# Altium schematic sheet GD32xx - Copy.SchDoc
size A3
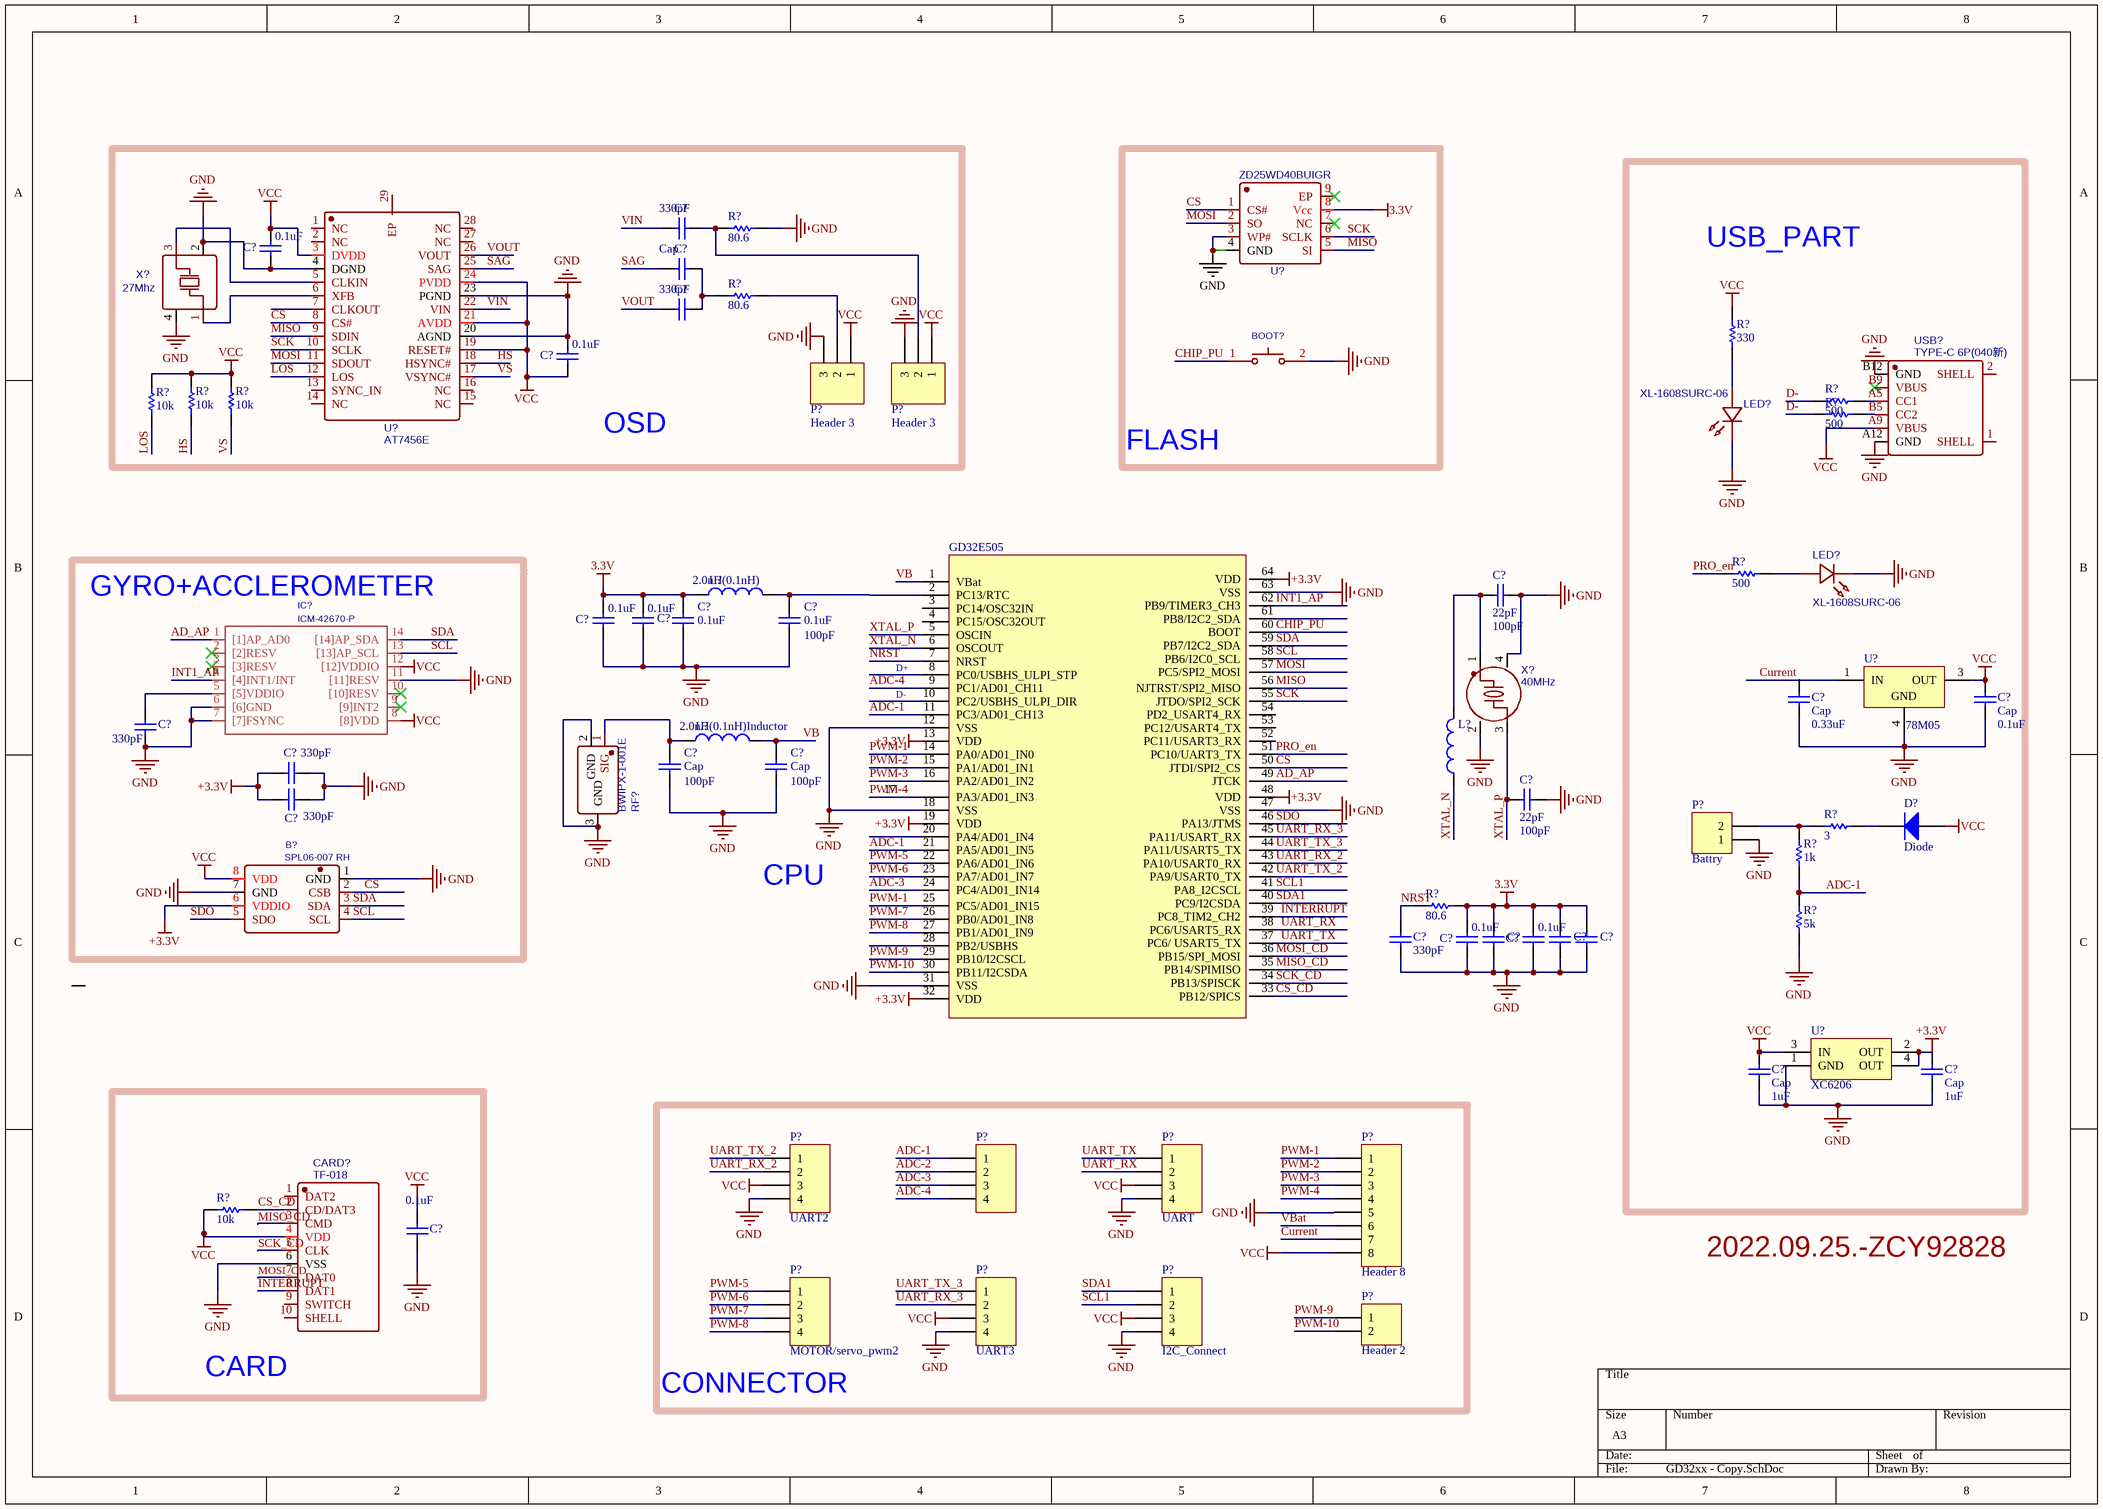
[diagram p0: GD32xx - Copy.SchDoc]

## Parts
(Parts that share a designator on the sheet are numbered #1, #2 ... from top to bottom, then left to right.)
B?  SPL06-007 RH  [SPI060007]
BOOT?  BUTTON2  [BOOT]  (value not drawn)
C?#1  330pF  [INDIA_SOP]
C?#2  0.1uF  [INDIA_SOP]
C?#3  Cap  [INDIA_SOP]
C?#4  330pF  [INDIA_SOP]
C?#5  0.1uF  [INDIA_SOP]
C?#6  22pF  value 100pF  [INDIA_SOP]
C?#7  0.1uF  [INDIA_SOP]
C?#8  0.1uF  [INDIA_SOP]
C?#9  0.1uF  [INDIA_SOP]
C?#10  0.1uF  value 100pF  [INDIA_SOP]
C?#11  Cap  value 0.33uF  [INDIA_SOP]
C?#12  Cap  value 0.1uF  [INDIA_SOP]
C?#13  330pF  [INDIA_SOP]
C?#14  330pF  [INDIA_SOP]
C?#15  Cap  value 100pF  [INDIA_SOP]
C?#16  Cap  value 100pF  [INDIA_SOP]
C?#17  330pF  [INDIA_SOP]
C?#18  22pF  value 100pF  [INDIA_SOP]
C?#19  0.1uF  [INDIA_SOP]
C?#20  0.1uF  [INDIA_SOP]  (value not drawn)
C?#21  0.1uF  [INDIA_SOP]
C?#22  0.1uF  [INDIA_SOP]  (value not drawn)
C?#23  0.1uF  [INDIA_SOP]  (value not drawn)
C?#24  330pF  [INDIA_SOP]
C?#25  Cap  value 1uF  [INDIA_SOP]
C?#26  Cap  value 1uF  [INDIA_SOP]
C?#27  0.1uF  [INDIA_SOP]
CARD?  TF-018  [SD_CARD]
D?  Diode  [SMC]
GD32E505  GD32?  [ESP32]  (value not drawn)
IC?  ICM-42670-P  [ICM42670]
L?#1  2.0nH(0.1nH)  [0402-A]
L?#2  2.0nH(0.1nH)Inductor  [0402-A]
L?#3  Inductor  [0402-A]  (value not drawn)
LED?#1  XL-1608SURC-06  [LED]
LED?#2  XL-1608SURC-06  [LED]
P?#1  Header 3  [HDR1X3]
P?#2  Header 3  [HDR1X3]
P?#3  Battry  [HDR1X2]
P?#4  UART2  [HDR1X4]
P?#5  MOTOR/servo_pwm2  [HDR1X4]  (value not drawn)
P?#6  UART  [HDR1X4]
P?#7  Header 8  [HDR1X8]
P?#8  MOTOR/servo_pwm2  [HDR1X4]
P?#9  UART3  [HDR1X4]
P?#10  I2C_Connect  [HDR1X4]
P?#11  Header 2  [HDR1X2]
R?#1  80.6  [INDIA_SOP]
R?#2  80.6  [INDIA_SOP]
R?#3  330  [INDIA_SOP]
R?#4  10k  [INDIA_SOP]
R?#5  10k  [INDIA_SOP]
R?#6  10k  [INDIA_SOP]
R?#7  500  [INDIA_SOP]
R?#8  500  [INDIA_SOP]
R?#9  500  [INDIA_SOP]
R?#10  1k  [INDIA_SOP]
R?#11  3  [INDIA_SOP]
R?#12  80.6  [INDIA_SOP]
R?#13  5k  [INDIA_SOP]
R?#14  10k  [INDIA_SOP]
RF?  BWIPX-1-001E  [RF]
U?#1  ZD25WD40BUIGR  [25_FLASH]
U?#2  AT7456E  [AD7456]
U?#3  78M05  [TD03B_N]
U?#4  XC6206  [XC6206]
USB?  TYPE-C 6P(040新)  [USB2.0]
X?#1  27Mhz  [CRYSTAL]
X?#2  40MHz  [CRYSTAL]

## Blocks framed on the sheet
OSD: C?#1-C?#5 P?#1 P?#2 R?#1 R?#2 R?#4-R?#6 U?#2 X?#1
FLASH: BOOT? U?#1
USB_PART: C?#11 C?#12 C?#25 C?#26 D? LED?#1 LED?#2 P?#3 R?#3 R?#7-R?#11 R?#13 U?#3 U?#4 USB?
GYRO+ACCLEROMETER: B? C?#13 C?#14 C?#17 IC?
CARD: C?#27 CARD? R?#14
CONNECTOR: P?#4-P?#11

## Nets
3.3V: C?#7.1 C?#8.1 C?#9.2 C?#19.1 C?#20.1 C?#21.1 C?#22.1 C?#23.1 L?#1.1 R?#12.2 U?#1.8(Vcc)
+3.3V: B?.6(VDDIO) C?#14.1 C?#17.1 GD32E505.13(VDD) GD32E505.19(VDD) GD32E505.32(VDD) GD32E505.48(VDD) GD32E505.64(VDD) U?#4.2(OUT) U?#4.4(OUT)
GND: B?.1(GND) B?.7(GND) BOOT?.2 C?#2.2 C?#5.1 C?#6.1 C?#7.2 C?#8.2 C?#9.1 C?#10.1 C?#11.2 C?#12.2 C?#13.1 C?#14.2 C?#15.1 C?#16.1 C?#17.2 C?#18.1 C?#19.2 C?#20.2 C?#21.2 C?#22.2 C?#23.2 C?#24.1 C?#25.2 C?#26.2 C?#27.1 CARD?.6(VSS) GD32E505.12(VSS) GD32E505.18(VSS) GD32E505.31(VSS) GD32E505.47(VSS) GD32E505.63(VSS) IC?.6([6]GND) IC?.7([7]FSYNC) IC?.11([11]RESV) LED?#1.1(K) LED?#2.1(K) P?#1.3 P?#2.3 P?#3.1 P?#4.4 P?#6.4 P?#7.5 P?#9.4 P?#10.4 R?#1.1 R?#13.2 RF?.2(GND) RF?.3(GND) U?#1.3(WP#) U?#1.4(GND) U?#2.4(DGND) U?#2.20(AGND) U?#2.23(PGND) U?#3.4(GND) U?#4.1(GND) USB?.A12(GND) USB?.B12(GND) X?#1.2(GND) X?#1.4(GND) X?#2.2(GND) X?#2.4(GND)
VCC: B?.8(VDD) C?#2.1 C?#5.2 C?#12.1 C?#25.1 C?#27.2 CARD?.4(VDD) D?.1(A) IC?.8([8]VDD) IC?.12([12]VDDIO) P?#1.1 P?#2.1 P?#4.3 P?#6.3 P?#7.8 P?#9.3 P?#10.3 R?#3.2 R?#4.1 R?#5.1 R?#6.1 R?#14.2 U?#2.3(DVDD) U?#2.19(RESET#) U?#2.21(AVDD) U?#2.24(PVDD) U?#3.3(OUT) U?#4.3(IN) USB?.A9(VBUS)
AD_AP: GD32E505.49(JTCK) IC?.1([1]AP_AD0)
ADC-1: GD32E505.11(PC3/AD01_CH13) GD32E505.21(PA5/AD01_IN5) P?#5.1 R?#10.2 R?#13.1
ADC-2: P?#5.2
ADC-3: GD32E505.24(PC4/AD01_IN14) P?#5.3
ADC-4: GD32E505.9(PC1/AD01_CH11) P?#5.4
CHIP_PU: BOOT?.1 GD32E505.60(BOOT)
CS: B?.2(CSB) GD32E505.50(JTDI/SPI2_CS) U?#1.1(CS#) U?#2.8(CS#)
CS_CD: CARD?.2(CD/DAT3) GD32E505.33(PB12/SPICS) R?#14.1
Current: P?#7.7 U?#3.1(IN)
D+: GD32E505.8(PC0/USBHS_ULPI_STP)
D-: GD32E505.10(PC2/USBHS_ULPI_DIR) R?#7.2 R?#8.2
HS: R?#5.2 U?#2.18(HSYNC#)
INT1_AP: GD32E505.62(PB9/TIMER3_CH3) IC?.4([4]INT1/INT)
INTERRUPT: CARD?.8(DAT1) GD32E505.39(PC8_TIM2_CH2)
LOS: R?#4.2 U?#2.12(LOS)
MISO: GD32E505.56(NJTRST/SPI2_MISO) U?#1.5(SI) U?#2.9(SDIN)
MISO_CD: CARD?.3(CMD) GD32E505.35(PB14/SPIMISO)
MOSI: GD32E505.57(PC5/SPI2_MOSI) U?#1.2(SO) U?#2.11(SDOUT)
MOSI_CD: CARD?.7(DAT0) GD32E505.36(PB15/SPI_MOSI)
NRST: C?#24.2 GD32E505.7(NRST) R?#12.1
PRO_en: GD32E505.51(PC10/UART3_TX) R?#9.2
PWM-1: GD32E505.14(PA0/AD01_IN0) GD32E505.25(PC5/AD01_IN15) P?#7.1
PWM-2: GD32E505.15(PA1/AD01_IN1) P?#7.2
PWM-3: GD32E505.16(PA2/AD01_IN2) P?#7.3
PWM-4: GD32E505.17(PA3/AD01_IN3) P?#7.4
PWM-5: GD32E505.22(PA6/AD01_IN6) P?#8.1
PWM-6: GD32E505.23(PA7/AD01_IN7) P?#8.2
PWM-7: GD32E505.26(PB0/AD01_IN8) P?#8.3
PWM-8: GD32E505.27(PB1/AD01_IN9) P?#8.4
PWM-9: GD32E505.29(PB10/I2CSCL) P?#11.1
PWM-10: GD32E505.30(PB11/I2CSDA) P?#11.2
SAG: C?#3.1 U?#2.25(SAG)
SCK: GD32E505.55(JTDO/SPI2_SCK) U?#1.6(SCLK) U?#2.10(SCLK)
SCK_CD: CARD?.5(CLK) GD32E505.34(PB13/SPISCK)
SCL: B?.4(SCL) GD32E505.58(PB6/I2C0_SCL) IC?.13([13]AP_SCL)
SCL1: GD32E505.41(PA8_I2CSCL) P?#10.2
SDA: B?.3(SDA) GD32E505.59(PB7/I2C2_SDA) IC?.14([14]AP_SDA)
SDA1: GD32E505.40(PC9/I2CSDA) P?#10.1
SDO: B?.5(SDO) GD32E505.46(PA13/JTMS)
UART_RX: GD32E505.38(PC6/USART5_RX) P?#6.2
UART_RX_2: GD32E505.43(PA10/USART0_RX) P?#4.2
UART_RX_3: GD32E505.45(PA11/USART_RX) P?#9.2
UART_TX: GD32E505.37(PC6/_USART5_TX) P?#6.1
UART_TX_2: GD32E505.42(PA9/USART0_TX) P?#4.1
UART_TX_3: GD32E505.44(PA11/USART5_TX) P?#9.1
VB: C?#16.2 GD32E505.1(VBat) L?#2.2
VBat: P?#7.6
VIN: C?#1.1 U?#2.22(VIN)
VOUT: C?#4.1 U?#2.26(VOUT)
VS: R?#6.2 U?#2.17(VSYNC#)
XTAL_N: GD32E505.6(OSCOUT) L?#3.1
XTAL_P: C?#18.2 GD32E505.5(OSCIN) X?#2.3
NetC?#1_2: C?#1.2 P?#2.2 R?#1.2
NetC?#3_2: C?#3.2 C?#4.2 R?#2.2
NetC?#6_2: C?#6.2 L?#3.2 X?#2.1
NetC?#10_2: C?#10.2 GD32E505.2(PC13/RTC) L?#1.2
NetC?#13_2: C?#13.2 IC?.5([5]VDDIO)
NetC?#15_2: C?#15.2 L?#2.1 RF?.1(SIG)
NetD?_2: D?.2(K) R?#11.1
NetLED?#1_2: LED?#1.2(A) R?#3.1
NetLED?#2_2: LED?#2.2(A) R?#9.1
NetP?#1_2: P?#1.2 R?#2.1
NetP?#3_2: P?#3.2 R?#10.1 R?#11.2
NetR?#7_1: R?#7.1 USB?.A5(CC1)
NetR?#8_1: R?#8.1 USB?.B5(CC2)
NetU?#2_5: U?#2.5(CLKIN) X?#1.3(OSC2)
NetU?#2_6: U?#2.6(XFB) X?#1.1(OSC1)

Not connected (* = marked no-connect by the designer): C?#11 1; C?#26 1; CARD? 1(DAT2) 9(SWITCH) 10(SHELL); GD32E505 3(PC14/OSC32IN) 4(PC15/OSC32OUT) 20(PA4/AD01_IN4) 28(PB2/USBHS) 52(PC11/USART3_RX) 53(PC12/USART4_TX) 54(PD2_USART4_RX) 61(PB8/I2C2_SDA); IC? 2([2]RESV)* 3([3]RESV)* 9([9]INT2)* 10([10]RESV)*; U?#1 7(NC)* 9(EP)*; U?#2 1(NC) 2(NC) 7(CLKOUT) 13(SYNC_IN) 14(NC) 15(NC) 16(NC) 27(NC) 28(NC) 29(EP); USB? 1(SHELL) 2(SHELL) B9(VBUS)*

## Notes on the sheet
- CPU
- 2022.09.25.-ZCY92828

## Library data of the parts
B? = SPL06-007 RH: BOM_Manufacturer: Goertek; Contributor: RoyHendrie; SMT Type: Extend; BOM_Supplier: LCSC; BOM_Supplier Part: C233787; BOM_Manufacturer Part: SPL06-007; BOM_JLCPCB SMD: Yes; spicePre: U; spiceSymbolName: SPL06-007 RH
BOOT? = BUTTON2: BOM_Manufacturer: null; Contributor: LCSC; BOM_Supplier: LCSC; BOM_Supplier Part: C9900005988; BOM_Manufacturer Part: BUTTON2; BOM_JLCPCB Part Class: Extended Part; spicePre: U; spiceSymbolName: BUTTON2
C?#1-C?#5 C?#7-C?#9 C?#13 C?#14 C?#17 C?#19-C?#24 C?#27 = Cap: Capacitor; Value: 100pF; Published: 8-Jun-2000; LatestRevisionDate: 17-Jul-2002; LatestRevisionNote: Re-released for DXP Platform.; PackageReference: RAD-0.3; Publisher: Altium Limited; PackageDescription: Radial Cap, Thru-Hole; 2 Leads; 0.3 in Pin Spacing
C?#6 C?#10-C?#12 C?#15 C?#16 C?#18 C?#25 C?#26 = Cap: Capacitor; Published: 8-Jun-2000; LatestRevisionDate: 17-Jul-2002; LatestRevisionNote: Re-released for DXP Platform.; PackageReference: RAD-0.3; Publisher: Altium Limited; PackageDescription: Radial Cap, Thru-Hole; 2 Leads; 0.3 in Pin Spacing
CARD? = TF-018: BOM_Manufacturer: 台湾汉博; Contributor: LCSC; BOM_Supplier: LCSC; BOM_Supplier Part: C961679; BOM_Manufacturer Part: TF-018; BOM_JLCPCB Part Class: Extended Part; spicePre: C; spiceSymbolName: TF-018
D? = Diode: Default Diode; Published: 8-Jun-2000; LatestRevisionDate: 17-Jul-2002; LatestRevisionNote: Re-released for DXP Platform.; PackageVersion: Sep-1996; PackageReference: SMC; Publisher: Altium Limited; PackageDescription: DO-214-AB/SMC; 2 C-Bend Leads; Body 7.9 x 5.9 mm, inc. leads (LxW); Code_JEDEC: DO-214-AB
IC? = ICM-42670-P: Contributor: ZatrepalekP; spicePre: I; spiceSymbolName: ICM-42670-P
L?#1-L?#3 = Inductor: Code_IEC: 1005; Value: 10mH; Published: 8-Jun-2000; LatestRevisionDate: 29-May-2009; LatestRevisionNote: IPC-7351 Footprint Added.; PackageReference: 0402-A; Publisher: Altium Limited; PackageDescription: Chip Inductor; Code_JEITA: 0402
LED?#1 LED?#2 = XL-1608SURC-06: BOM_Manufacturer: XINGLIGHT(成兴光); Contributor: LCSC; BOM_Supplier: LCSC; BOM_Supplier Part: C965799; BOM_Manufacturer Part: XL-1608SURC-06; BOM_JLCPCB Part Class: Extended Part; spicePre: L; spiceSymbolName: XL-1608SURC-06
P?#1 P?#2 = Header 3: Header, 3-Pin; LatestRevisionDate: 17-Jul-2002; LatestRevisionNote: Re-released for DXP Platform.; Publisher: Altium Limited
P?#3 P?#11 = Header 2: Header, 2-Pin; LatestRevisionDate: 17-Jul-2002; LatestRevisionNote: Re-released for DXP Platform.; Publisher: Altium Limited
P?#4-P?#6 P?#8-P?#10 = Header 4: Header, 4-Pin; LatestRevisionDate: 17-Jul-2002; LatestRevisionNote: Re-released for DXP Platform.; Publisher: Altium Limited
P?#7 = Header 8: Header, 8-Pin; LatestRevisionDate: 17-Jul-2002; LatestRevisionNote: Re-released for DXP Platform.; Publisher: Altium Limited
R?#1-R?#14 = Res1: Resistor; Published: 8-Jun-2000; LatestRevisionDate: 17-Jul-2002; LatestRevisionNote: Re-released for DXP Platform.; PackageReference: AXIAL-0.3; Publisher: Altium Limited; PackageDescription: Axial Device, Thru-Hole; 2 Leads; 0.3 in Pin Spacing
RF? = BWIPX-1-001E: BOM_Manufacturer: BAT WIRELESS(蝙蝠无线); Contributor: LCSC; BOM_Supplier: LCSC; BOM_Supplier Part: C496552; BOM_Manufacturer Part: BWIPX-1-001E; BOM_JLCPCB Part Class: Extended Part; spicePre: R; spiceSymbolName: BWIPX-1-001E
U?#1 = ZD25WD40BUIGR: BOM_Manufacturer: Zetta(澜智); Contributor: LCSC; BOM_Supplier: LCSC; BOM_Supplier Part: C2759917; BOM_Manufacturer Part: ZD25WD40BUIGR; BOM_JLCPCB Part Class: Extended Part; spicePre: U; spiceSymbolName: ZD25WD40BUIGR
U?#2 = AT7456E: BOM_Manufacturer: ZHONGKEWEI; BOM_Supplier: LCSC; BOM_Manufacturer Part: AT7456E; BOM_Supplier Part: C82351; BOM_JLCPCB Part Class: Extended Part; spicePre: U; spiceSymbolName: AT7456E
U?#3 = LM78M05CDT: 3-Terminal Positive Voltage Regulators; Manufacturer: National Semiconductor; CompType: LDO IC; PackageTopMarking: NSUZXYTT*LM78M05*CDT; PowerWise: N; Published: 4-Dec-2008; DatasheetVersion: Aug-2005; PackageVersion: revC, Apr-2003; PackageReference: TD03B; Publisher: Altium Limited; PackageDescription: TO252, Molded, Jedec, 6.8 x 6.10 x 2.30mm Body, 3 Lead, 2.28mm Pitch, Surface Mount; PartNumber: LM78M05CDT; RoHS: O; PinCount: 3; DigiKeyPartNumber: LM78M05CDT-ND; Code_JEDEC: TO-252-AA; ComponentLink1Description: LM78M05 Datasheet; ComponentLink1URL: http://www.national.com/ds/LM/LM78M05.pdf; ComponentLink2Description: LM78M05 Web Page; ComponentLink2URL: http://www.national.com/pf/LM/LM78M05.html; ComponentLink3Description: TD03B Package Page; ComponentLink3URL: http://www.national.com/packaging/folders/td03b.html
U?#4 = REG1117-3.3: 800mA and 1A Low Dropout Positive Regulator 2.85V, 3.3V, 5V, and Adjustable; Published: 8-Jun-2000; LatestRevisionDate: 17-Jul-2002; LatestRevisionNote: Re-released for DXP Platform.; DatasheetVersion: Sep-1997; PackageVersion: revC; PackageReference: ZZ311; Publisher: Altium Limited; PackageDescription: SOT-223/SC-73; 4 Leads; Body 6.7 x 7.3 mm, inc. leads (LxW max); ComponentLink1Description: Manufacturer Link; ComponentLink1URL: http://www.ti.com/; ComponentLink2Description: Datasheet; ComponentLink2URL: http://www-s.ti.com/sc/ds/REG1117.pdf
USB? = TYPE-C 6P(040新): BOM_Manufacturer: SHOU HAN(首韩); Contributor: LCSC; BOM_Supplier: LCSC; BOM_Supplier Part: C2887422; BOM_Manufacturer Part: TYPE-C 6P(040新); BOM_JLCPCB Part Class: Extended Part; spicePre: U; spiceSymbolName: TYPE-C 6P(040新)
X?#1 = 27Mhz: BOM_Manufacturer: Zhejiang Abel Elec; BOM_Manufacturer Part: SMD-3225_4P27MHZ12PF10PPM-40~+85℃; nameAlias: Frequency; Contributor: LCSC; BOM_Supplier: LCSC; BOM_Supplier Part: C164057; BOM_JLCPCB Part Class: Extended Part; spicePre: X; spiceSymbolName: SMD-3225_4P27MHZ12PF10PPM-40~+85℃
X?#2 = 40MHz: BOM_Manufacturer: interquip(应达利); BOM_Manufacturer Part: 5YMA40000151SF40Q1; nameAlias: Frequency; Contributor: lcsc; BOM_Supplier: LCSC; BOM_Supplier Part: C3003278; spicePre: X; spiceSymbolName: 5YMA40000151SF40Q1